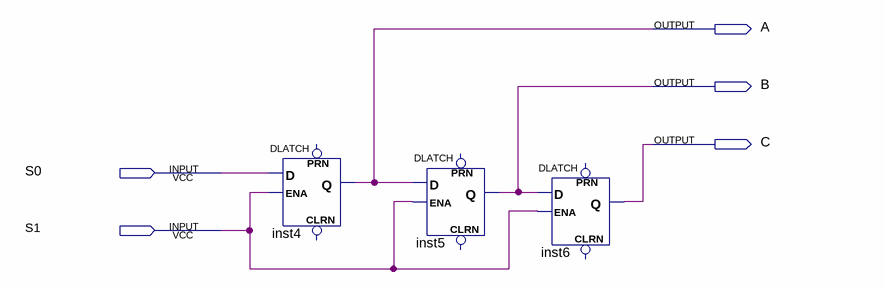
[diagram p0: schematic sheet]
// Quartus schematic exercise1.bdf as structural Verilog: 3 symbols, 5 pins
module exercise1 (
  input  S0,
  input  S1,
  output A,
  output B,
  output C
);

  DLATCH inst4 (.D(S0), .ENA(S1), .Q(A));  // open: CLRN, PRN
  DLATCH inst5 (.D(A), .ENA(S1), .Q(B));  // open: CLRN, PRN
  DLATCH inst6 (.D(B), .ENA(S1), .Q(C));  // open: CLRN, PRN
endmodule
